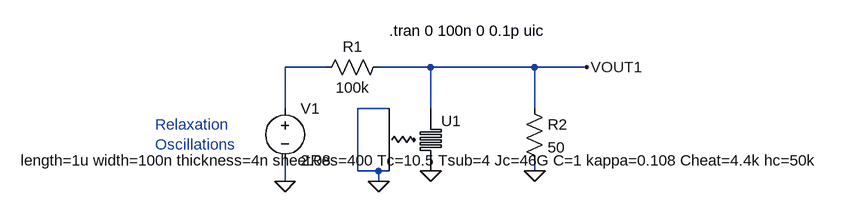
[diagram p0: schematic relaxation-oscillations-fully-dynamic.asc]
relaxation-oscillations-fully-dynamic.asc, the LTspice schematic file:
Version 4
SHEET 1 880 680
WIRE -208 -608 -272 -608
WIRE -48 -608 -128 -608
WIRE 112 -608 -48 -608
WIRE 192 -608 112 -608
WIRE -272 -544 -272 -608
WIRE -112 -544 -160 -544
WIRE -48 -544 -48 -608
WIRE 112 -544 112 -608
WIRE -160 -448 -160 -544
WIRE -128 -448 -160 -448
WIRE -112 -448 -128 -448
WIRE 112 -448 112 -464
WIRE -272 -432 -272 -464
WIRE -128 -432 -128 -448
FLAG 112 -448 0
FLAG -48 -448 0
FLAG -128 -432 0
FLAG -272 -432 0
FLAG 192 -608 VOUT1
SYMBOL snspdWithPhotonPort -48 -496 R0
SYMATTR InstName U1
SYMATTR Value Lind=70n
SYMBOL res 96 -560 R0
SYMATTR InstName R2
SYMATTR Value 50
SYMBOL voltage -272 -560 R0
WINDOW 123 0 0 Left 2
SYMATTR InstName V1
SYMATTR Value 2.08
SYMATTR SpiceLine Rser=0
SYMBOL res -112 -624 R90
WINDOW 0 0 56 VBottom 2
WINDOW 3 32 56 VTop 2
SYMATTR InstName R1
SYMATTR Value 100k
TEXT -112 -664 Left 2 !.tran 0 100n 0 0.1p uic
TEXT -472 -520 Left 2 ;Relaxation \nOscillations

The netlist it stands for:
* relaxation-oscillations-fully-dynamic.asc
XU1 0 0 VOUT1 0 nanowireDynamic Lind=70n length=1u width=100n thickness=4n sheetRes=400 Tc=10.5 Tsub=4 Jc=46G C=1 kappa=0.108 Cheat=4.4k hc=50k  ; pins gate-in photon-out source drain
R2 VOUT1 0 50
V1 N001 0 2.08 Rser=0
R1 VOUT1 N001 100k
.tran 0 100n 0 0.1p uic
* Relaxation
* Oscillations
.lib snspd.lib
.backanno
.end